# EAGLE design arm_femur_wLED (EAGLE 7.3.0)
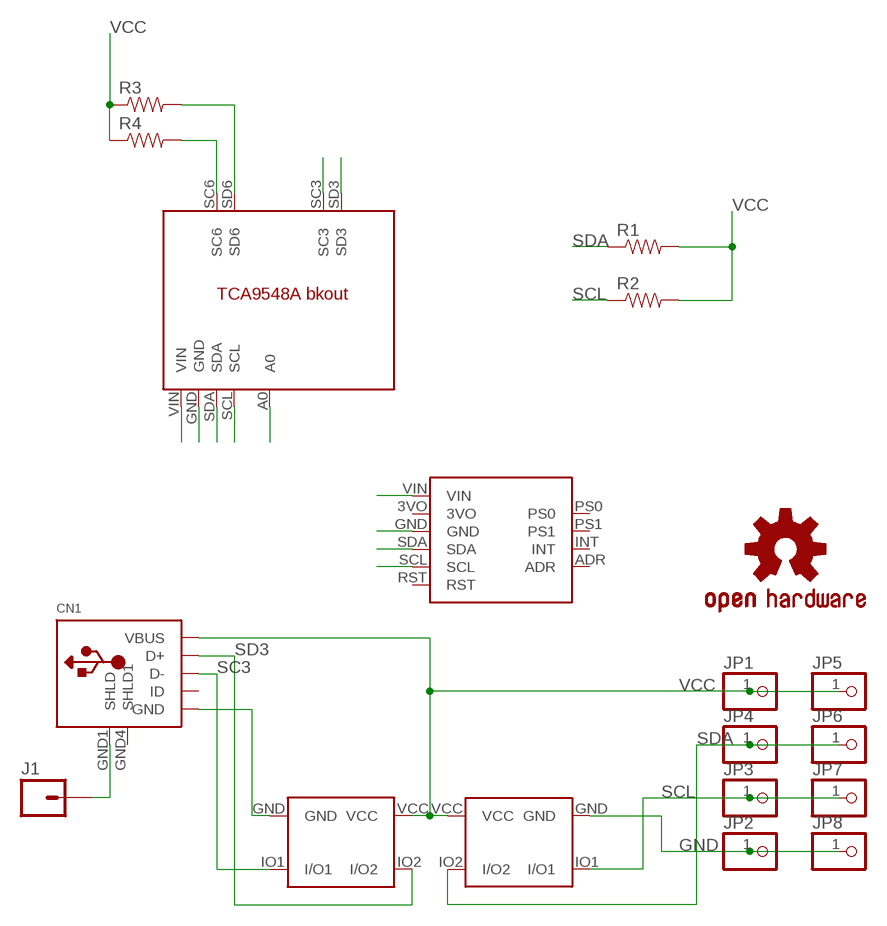
[diagram p0: schematic, sheet 1]

## Parts
CN1  USB  [USB-MINIB-THM-MOLEX_NOSLK]
J1  M01PTH  [1X01]
JP1  PINHD-1X1CB  [1X01-CLEANBIG]
JP2  PINHD-1X1CB  [1X01-CLEANBIG]
JP3  PINHD-1X1CB  [1X01-CLEANBIG]
JP4  PINHD-1X1CB  [1X01-CLEANBIG]
JP5  PINHD-1X1CB  [1X01-CLEANBIG]
JP6  PINHD-1X1CB  [1X01-CLEANBIG]
JP7  PINHD-1X1CB  [1X01-CLEANBIG]
JP8  PINHD-1X1CB  [1X01-CLEANBIG]
LOGO1  OSHW-LOGOM  [OSHW-LOGO-M]
R1  RESISTORAXIAL-0.3  [AXIAL-0.3]
R2  RESISTORAXIAL-0.3  [AXIAL-0.3]
R3  RESISTORAXIAL-0.3  [AXIAL-0.3]
R4  RESISTORAXIAL-0.3  [AXIAL-0.3]
U$1  BNO_055_BKOUT  [BNO_BKOUT]
U$2  TCA9548_ARM_FEMUR  [TCA9548_ARM_FEMUR]
U$3  TVS_ARRAY_CD143A  [SOT-143]
U$4  TVS_ARRAY_CD143A  [SOT-143]

## Nets
GND: CN1.GND JP2.1 JP8.1 U$1.GND U$2.GND U$3.GND U$4.GND
N$4: CN1.GND1(SHLD) J1.1
SC3: CN1.D- U$2.SC3 U$4.IO1(I/O1)
SC6: R4.P$2 U$1.SCL U$2.SC6
SCL: JP3.1 JP7.1 R2.P$1 U$2.SCL U$3.IO1(I/O1)
SD3: CN1.D+ U$2.SD3 U$4.IO2(I/O2)
SD6: R3.P$2 U$1.SDA U$2.SD6
SDA: JP4.1 JP6.1 R1.P$1 U$2.SDA U$3.IO2(I/O2)
VCC: CN1.VBUS JP1.1 JP5.1 R1.P$2 R2.P$2 R3.P$1 R4.P$1 U$1.VIN U$2.A0 U$2.VIN U$3.VCC U$4.VCC
Unconnected: CN1.GND4(SHLD1) CN1.ID U$1.3VO U$1.ADR U$1.INT U$1.PS0 U$1.PS1 U$1.RST

## Library data of the parts
CN1 = adafruit:USB: USB Connectors USBMINIB - Surface Mount Female Mini-B USB Connector 4UConnector: 06564 By microbuilder.eu Thru-hole RA Female Mini-B USB Connector 4UConnector: 18732 By ladyada.net
J1 = SparkFun-Connectors:M01: Header 1 Standard 1-pin 0.1" header. Use with straight break away headers (SKU : PRT-00116), right angle break away headers (PRT-00553), swiss pins (PRT-00743), machine pins (PRT-00117), and female headers (PRT-00115). SMTSO-256-ET is a "flush mount" nut for a 4-40 screw. The older package used to be too tight, and did not allow it to sit properly thru the drill hit. The latest (0.165DIA) fits nice and snug.
JP1-JP8 = adafruit:PINHD-1X1: Pin header 1x1 for 0.1" spacing With round pins
LOGO1 = SparkFun-Aesthetics:OSHW-LOGO: Open Source Hardware Logo This logo indicates the piece of hardware it is found on incorporates a OSHW license and/or adheres to the definition of open source hardware found here: http://freedomdefined.org/OSHW
R1-R4 = SparkFun-Passives:RESISTOR: Resistor Basic schematic elements and footprints for 0603, 1206, and PTH resistors.
U$1 = skeleton:BNO_055_BKOUT
U$2 = skeleton:TCA9548_ARM_FEMUR
U$3 U$4 = skeleton:TVS_ARRAY_CD143A

## Board
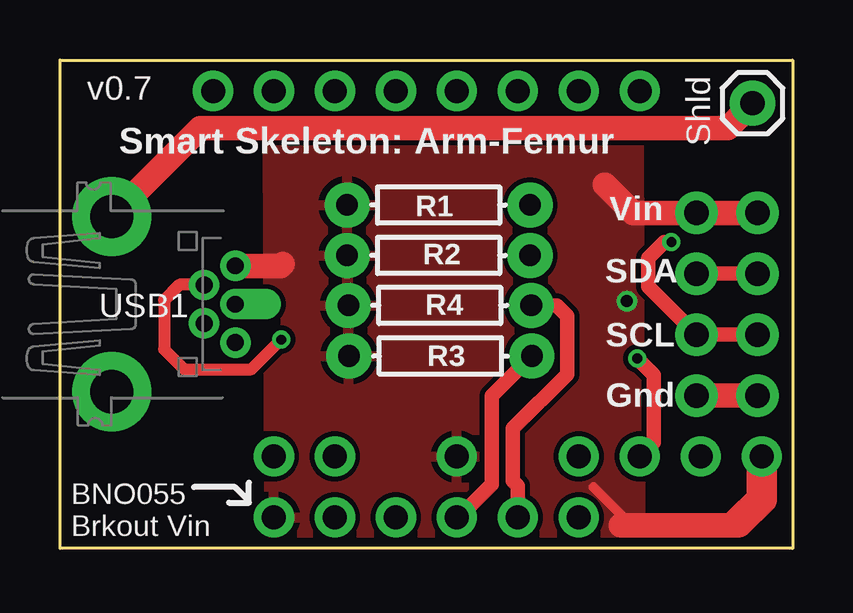
[diagram p1: board, top side]
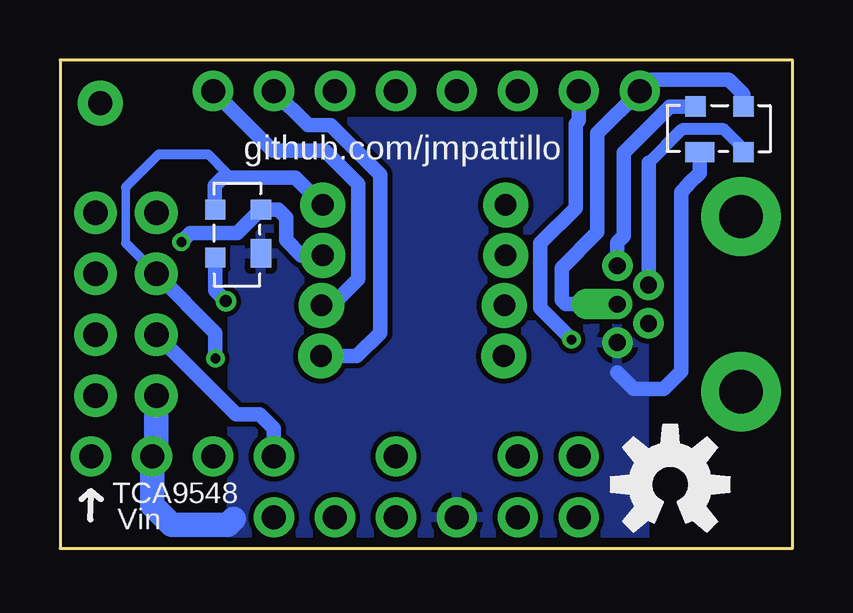
[diagram p2: board, bottom side, seen from below]

Size 30.53 x 20.37 mm. Coordinates in mm from the lower left corner, seen from the top.
Outline: 0,20.37 30.53,20.37 30.53,0 0,0 0,20.37
Copper layers (1*16): Top 0.0356mm / dielectric 1.5011mm / Bottom 0.0356mm
Design rules "LaenPCBOrder *": minimum track width 6mil, minimum drill 13mil, track to track 8mil, track to pad 8mil, pad to pad 8mil, via to via 6mil, smd to smd 6mil, copper to edge 15mil, drill to drill 6mil, minimum pad ring 7mil, minimum via ring 7mil, stop-mask expansion 0mil, vias tented up to drill 25mil, thermal gap 10mil

### Footprints (pad centres in the part's own frame; a part is rotated, then mirrored left to right if it is on the bottom)
USB-MINIB-THM-MOLEX_NOSLK = drill 0.7 pad 1.27 offset: D+ 0,9.72 | drill 0.7 pad 1.27: D- -0.8,8.42; GND 1.6,9.72; ID 0.8,8.42; VBUS -1.6,9.72 | drill 1.8 pad 3.302: GND1 -3.65,4.57; GND4 3.65,4.57
1X01 = drill 1.016 pad 1.88: 1 0,0
1X01-CLEANBIG = drill 1.016 pad 1.778: 1 0,0
AXIAL-0.3 = drill 0.9 pad 1.88: P$1 -3.81,0; P$2 3.81,0
BNO_BKOUT = drill 1 pad 1.676: 3VO -3.81,-8.89; ADR 3.81,8.89; GND -1.27,-8.89; INT 1.27,8.89; PS0 -3.81,8.89; PS1 -1.27,8.89; RST 6.35,-8.89; SCL 3.81,-8.89; SDA 1.27,-8.89; VIN -6.35,-8.89
TCA9548_ARM_FEMUR = drill 1 pad 1.676: A0 -1.27,-7.62; GND -11.43,-7.62; SC3 6.35,7.62; SC6 -8.89,7.62; SCL -6.35,-7.62; SD3 8.89,7.62; SD6 -6.35,7.62; SDA -8.89,-7.62; VIN -13.97,-7.62
SOT-143 = smd 1.2 x 0.85: GND -0.75,-0.95 | smd 0.85 x 0.85: IO1 1.075,-0.95; IO2 1.075,0.95; VCC -0.925,0.95

### Placement (x,y rotation side)
CN1  -2.41,10.19 270 top
J1  28.85,18.57 270 top
JP1  29.06,14 0 top
JP2  29.06,6.38 0 top
JP3  29.06,8.92 0 top
JP4  29.06,11.46 0 top
JP5  26.52,14 0 top
JP6  26.52,11.46 0 top
JP7  26.52,8.92 0 top
JP8  26.52,6.38 0 top
LOGO1  5.11,2.67 0 bottom
R1  15.77,14.33 180 top
R2  15.77,12.22 180 top
R3  15.85,8.03 0 top
R4  15.82,10.13 0 top
U$1  15.27,10.19 0 top
U$2  15.27,11.46 0 bottom
U$3  23.11,13.06 90 bottom
U$4  3.12,17.48 0 bottom

### Tracks (layer width: path | path; a pad name or v marks a point on that pad's centre or on a via)
GND
  Top 1.016: JP2.1 JP8.1
  Bottom 0.61: U$4.GND 3.87,15.66 4.34,15.19 4.34,15.16 4.65,14.86 4.65,7.39 5.38,6.65 6.63,6.65 7.32,7.34
  Bottom 1.016: JP8.1 26.52,4.01 U$2.GND 26.7,1.8 25.88,0.99 23.55,0.99 23.29,1.24
  pour Bottom: 6.22,17.81 23.32,17.78 23.39,0.05 6.17,0.03
N$4
  Top 1.016: CN1.GND1 5.85,17.53 27.81,17.53 J1.1
NC1  (via drill 1 pad 1.68)
  other vias: 11.46,3.84
NC2  (via drill 1 pad 1.68)
  other vias: 8.92,3.84
SC3  (via drill 0.4)
  Top 0.508: 5.99,11 4.98,11 4.34,10.36 4.34,8.31 5.18,7.47 7.98,7.47 v9.22,8.71
  Top 0.61: 5.99,11 CN1.D-
  Bottom 0.508: 2.05,16.65 2.87,17.48 4.62,17.48 6.01,16.09
  Bottom 0.61: v9.22,8.71 9.22,8.74 10.52,10.03 10.52,12.73 9.04,14.2 9.04,17.7 8.92,17.83 U$2.SC3 | U$4.IO1 2.05,16.65 | 6.01,16.09 CN1.D-
SC6
  Top 0.61: R4.P$2 20.7,10.13 21.13,9.7 21.13,7.26 18.87,5 18.87,2.82 19.08,2.62 U$1.SCL
  Bottom 0.61: U$2.SC6 21.67,16.59 19.51,16.59 18.11,15.19 18.11,11.23 19.2,10.13 R4.P$2
SCL  (via drill 0.4)
  Top 0.61: JP3.1 JP7.1 24.51,10.92 24.51,12.12 25.17,12.78 v25.48,12.78
  Bottom 0.61: U$2.SCL 21.62,5 22.2,5.59 23.19,5.59 JP7.1 | R2.P$1 20.47,12.22 21.11,12.85 21.11,13.79 21.44,14.12 22.16,14.12 U$3.IO1 23.14,13.16 25.1,13.16 v25.48,12.78
SD3
  Bottom 0.356: 8.02,13.31 8.14,13.19
  Bottom 0.61: CN1.D+ 9.45,10.19 9.63,10.36 9.63,11.7 8.14,13.19 8.14,17.31 U$2.SD3 5.89,19.56 2.67,19.56 2.06,18.95 2.06,18.43 U$4.IO2
SD6
  Top 0.61: R3.P$2 17.98,6.35 17.98,2.67 16.61,1.3 U$1.SDA
  Bottom 0.61: R3.P$2 18.16,8.03 17.2,8.99 17.2,15.6 19.25,17.65 20.19,17.65 U$2.SD6
SDA  (via drill 0.4)
  Top 0.61: JP4.1 JP6.1 26.52,11.43 | v24.05,7.92 24.74,7.24 24.74,4.42 U$2.SDA
  Bottom 0.356: 27.79,15.06 27.79,12.73
  Bottom 0.406: 27.79,12.73 JP6.1 | 27.79,15.06 26.42,16.43 24.36,16.43 23.6,15.67 23.6,15.47
  Bottom 0.61: 26.52,11.43 JP6.1 24.05,8.99 v24.05,7.92 | R1.P$1 20.73,15.47 23.6,15.47 23.75,15.47 24.08,15.14 24.08,14.15 U$3.IO2
VCC  (via drill 0.5)
  Top 0.406: 23.37,0.97 23.37,1.42 22.23,2.57
  Top 1.016: 28.27,1.09 28.14,0.97 23.37,0.97 | JP1.1 JP5.1 23.88,14 22.71,15.16 | CN1.VBUS 9.19,11.79 9.27,11.86
  Top 1.27: 28.27,1.09 29.24,2.06 U$2.VIN
  Bottom 0.61: U$3.VCC 24.06,10.75 v23.62,10.31 | CN1.VBUS 7.31,12.76 7.04,13.03 7.04,16.51 5.12,18.43 U$4.VCC
  pour Top: 8.66,17.75 24.1,17.6 24.18,-0.15 8.71,0.18

### Text on the board
tPlace: v0.7 | Smart Skeleton: Arm-Femur
tNames: Shld | Vin | SDA | USB1 | SCL | Gnd | BNO055 / Brkout Vin
bNames: github.com/jmpattillo | TCA9548 | Vin